# EAGLE design PIO_connector (EAGLE 6.4)
PROJECT: RGB_driver
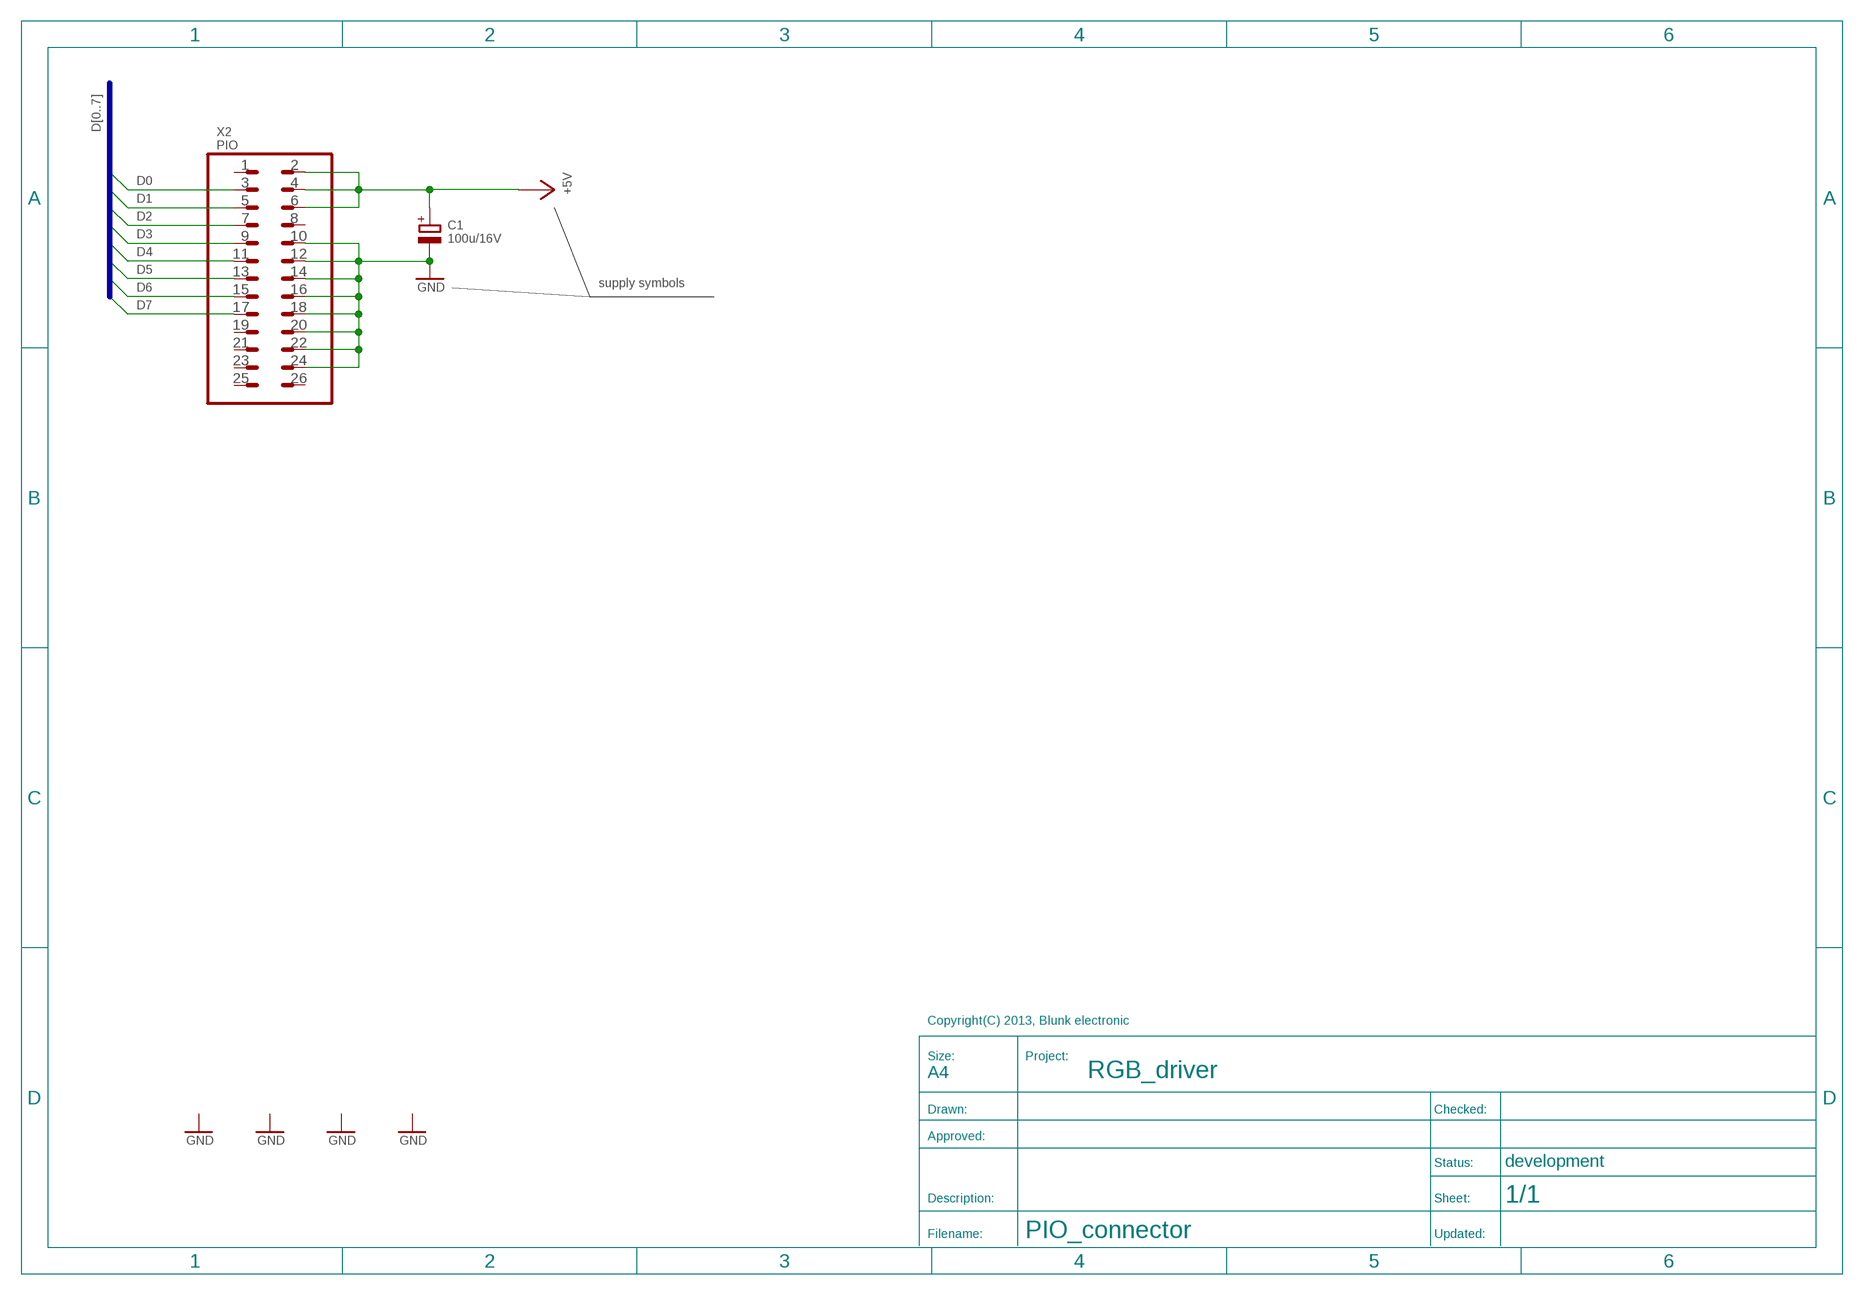
[diagram p0: schematic, sheet 1]
U$2 (A4_LANDSCAPE_DEVELOPMENT): COMMISSIONED: 2013-03-26

## Parts
C1  100u/16V  C_POL_EU_T_D7/2.54  [T_D7/2.54]
X2  PIO  MALE_2X13-T-0  [T_PINHEAD_2X13-0]

## Nets
+5V [PWR]: C1.+ X2.2 X2.4 X2.6
D0: X2.3
D1: X2.5
D2: X2.7
D3: X2.9
D4: X2.11
D5: X2.13
D6: X2.15
D7: X2.17
GND [PWR]: C1.- X2.10 X2.12 X2.14 X2.16 X2.18 X2.20 X2.22 X2.24
Unconnected: X2.1 X2.8 X2.19 X2.21 X2.23 X2.25 X2.26

## Buses
D[0..7]

## Notes on the sheet
- supply symbols

## Library data of the parts
C1 = be_rcl:C_POL_EU: Polarized Capacitor Device EU drawn: Mario Blunk / Blunk electronic; COMMISSIONED: 2013-05-06
X2 = be_con_jump:MALE_2X13: male connector device 2x13 drawn: Mario Blunk / Blunk electronic; COMMISSIONED: 2013-05-06

## Board
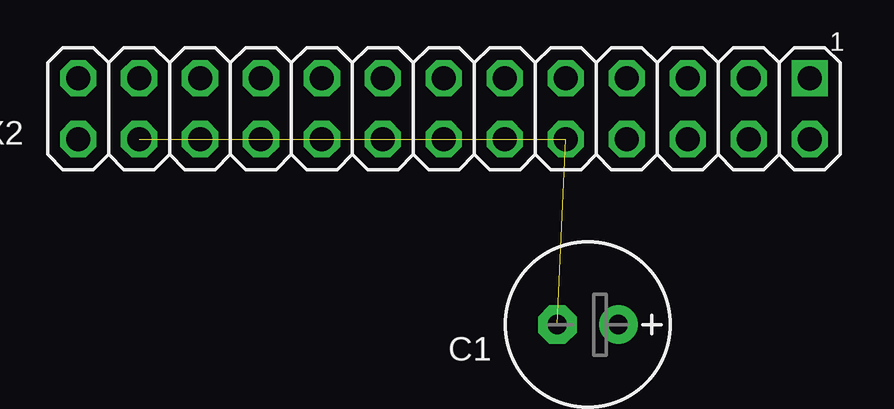
[diagram p1: board, top side]
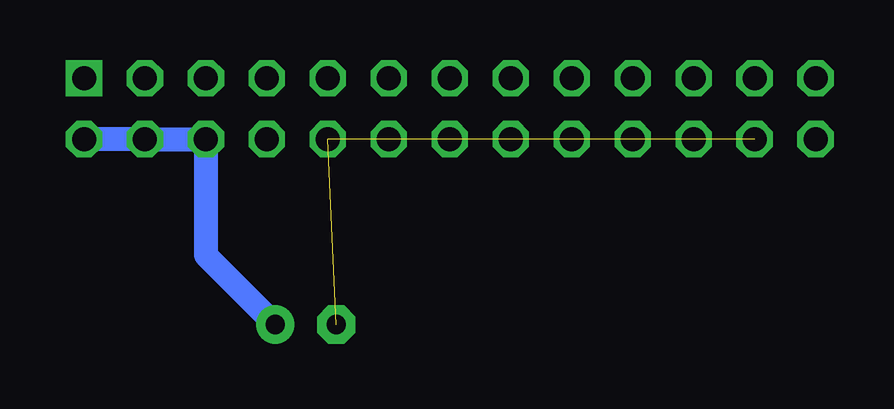
[diagram p2: board, bottom side, seen from below]

No outline drawn. Coordinates in mm, seen from the top.
Copper layers (1*16): Top 0.035mm / dielectric 1.5mm / Bottom 0.035mm
Design rules "default": minimum track width 10mil, minimum drill 0.6mm, track to track 8mil, track to pad 8mil, pad to pad 8mil, via to via 8mil, smd to smd 8mil, copper to edge 40mil, drill to drill 8mil, minimum pad ring 10mil, minimum via ring 8mil, stop-mask expansion 4mil, vias tented up to drill 0mil, thermal gap 10mil

### Footprints (pad centres in the part's own frame; a part is rotated, then mirrored left to right if it is on the bottom)
T_D7/2.54 = drill 0.8 pad 1.6: + -1.27,0 | drill 0.8 pad 1.6 octagon: - 1.27,0
T_PINHEAD_2X13-0 = drill 1 square: 1 -15.24,-1.27 | drill 1 octagon: 2 -15.24,1.27; 3 -12.7,-1.27; 4 -12.7,1.27; 5 -10.16,-1.27; 6 -10.16,1.27; 7 -7.62,-1.27; 8 -7.62,1.27; 9 -5.08,-1.27; 10 -5.08,1.27; 11 -2.54,-1.27; 12 -2.54,1.27; 13 0,-1.27; 14 0,1.27; 15 2.54,-1.27; 16 2.54,1.27; 17 5.08,-1.27; 18 5.08,1.27; 19 7.62,-1.27; 20 7.62,1.27; 21 10.16,-1.27; 22 10.16,1.27; 23 12.7,-1.27; 24 12.7,1.27; 25 15.24,-1.27; 26 15.24,1.27

### Placement (x,y rotation side)
C1  27,5 180 top
X2  21,14 180 top

### Tracks (layer width: path | path; a pad name or v marks a point on that pad's centre or on a via)
+5V
  Bottom 1: X2.2 X2.4 X2.6 31.16,7.89 C1.+
GND  (8 unrouted)